# Altium schematic sheet WX0.007.418DL.SchDoc
size A3
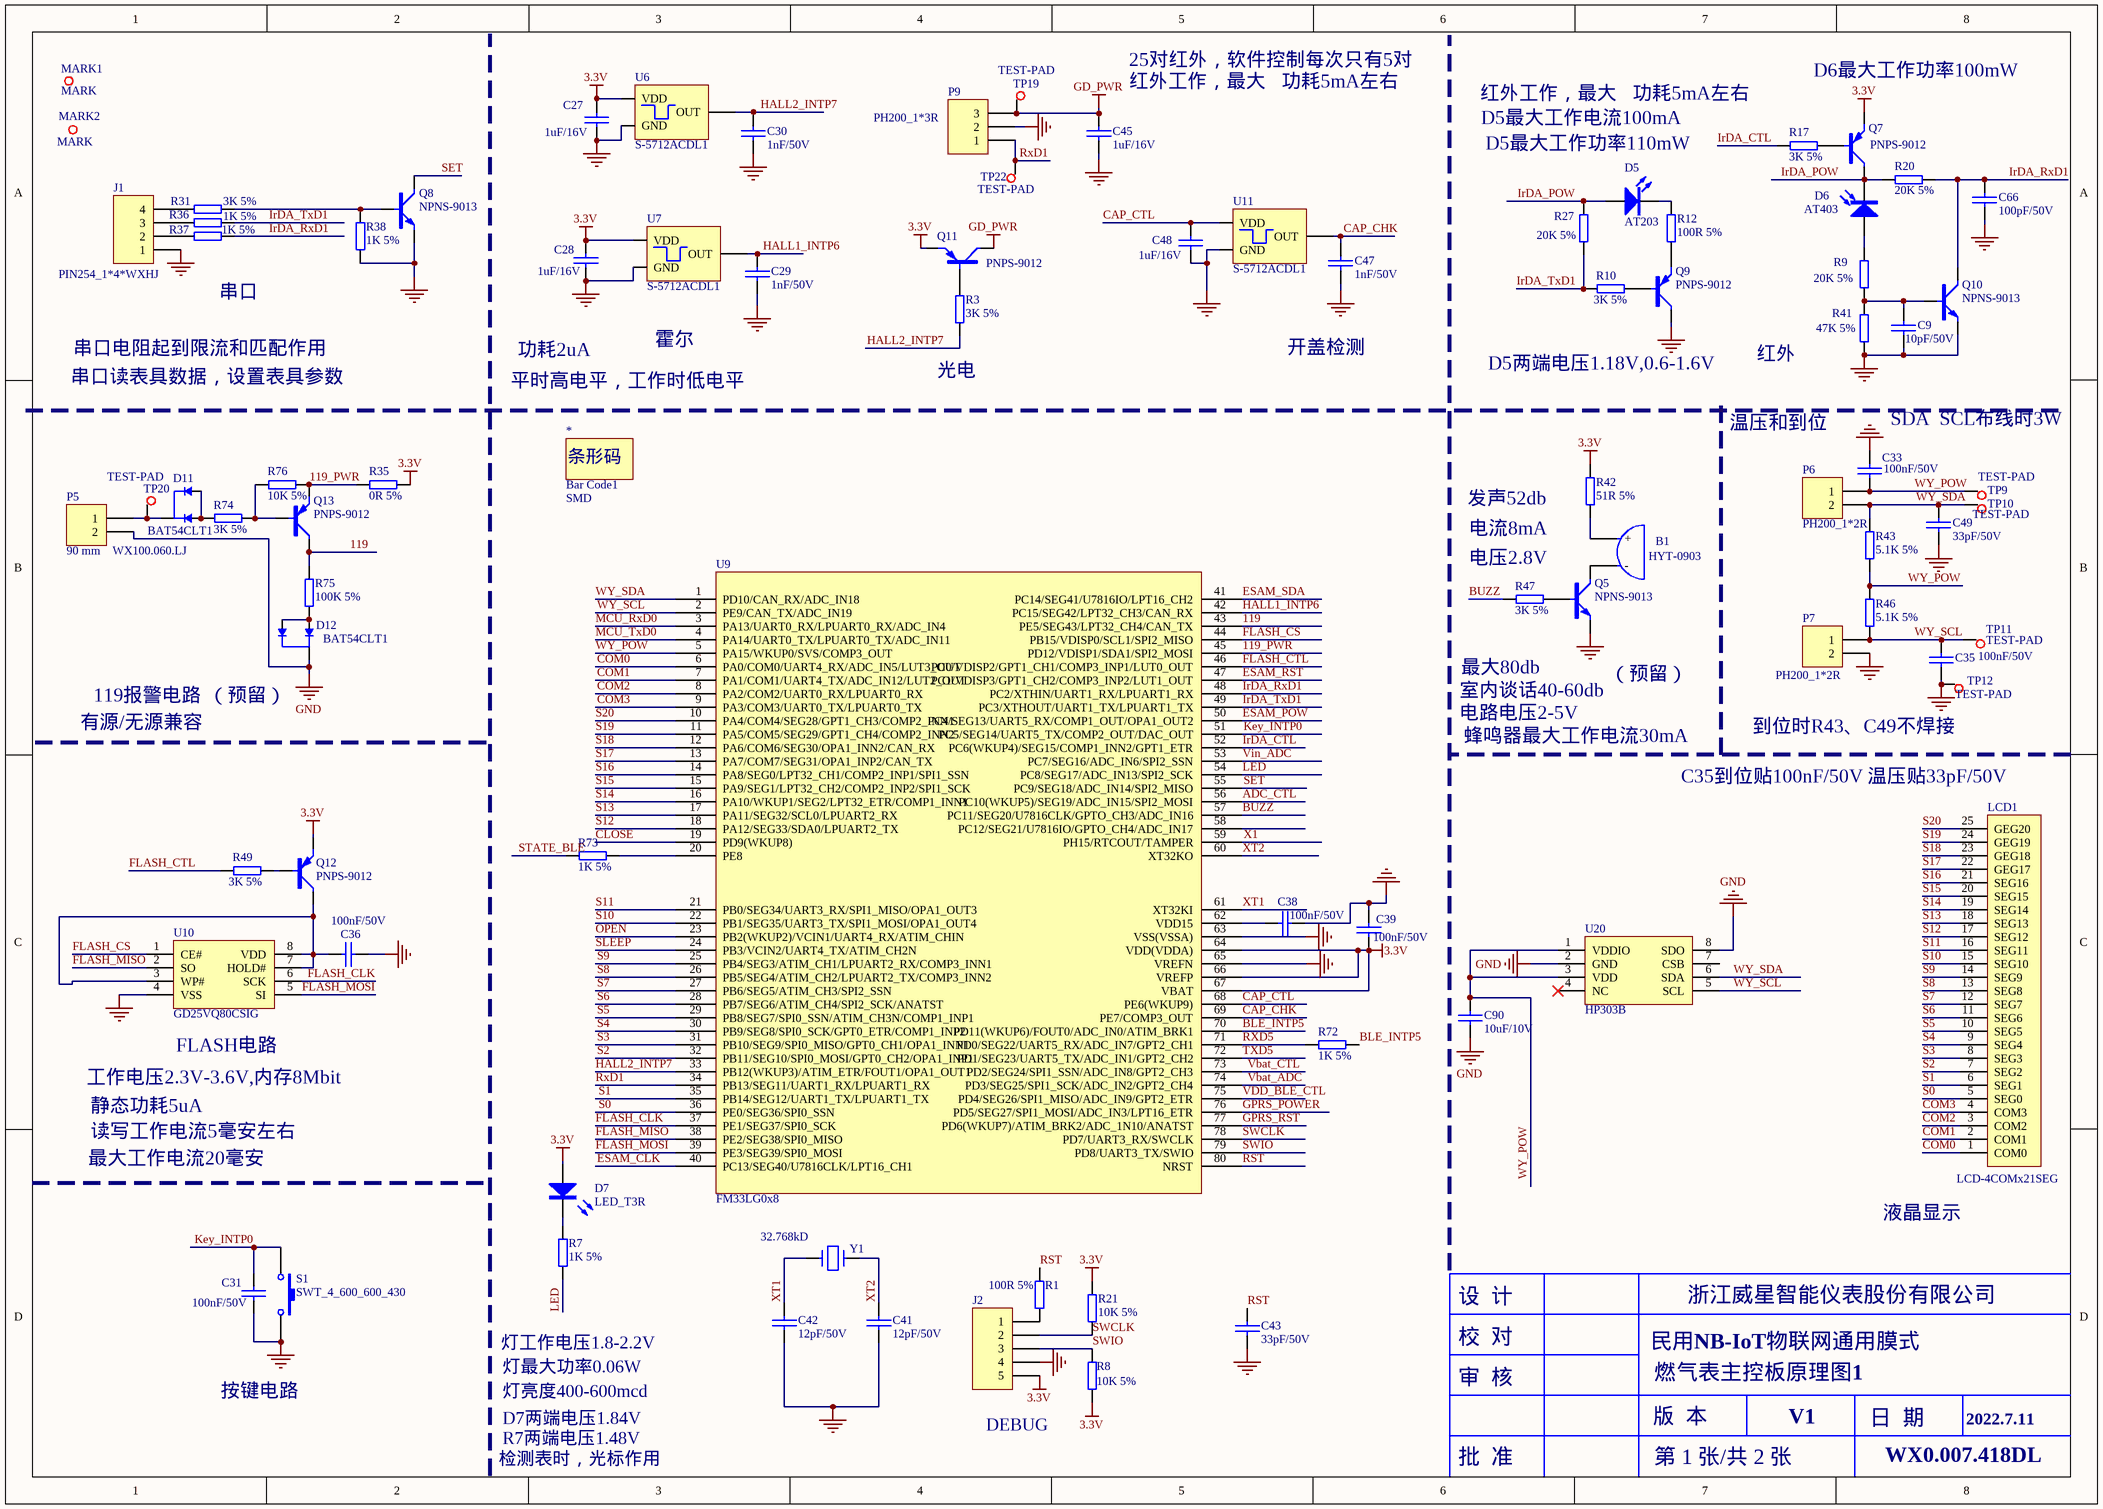
[diagram p0: WX0.007.418DL.SchDoc]

## Parts
*  Bar Code1  SMD/DIP: SMD  [Bar Code1]
B1  HYT-0903  [HYT-0903]
C9  10pF/50V  [CAP0603]
C27  1uF/16V  [CAP0603]
C28  1uF/16V  [CAP0603]
C29  1nF/50V  [CAP0603]
C30  1nF/50V  [CAP0603]
C31  100nF/50V  [CAP0603]
C33  100nF/50V  [CAP0603]
C35  100nF/50V  [CAP0603]
C36  100nF/50V  [CAP0603]
C38  100nF/50V  [CAP0603]
C39  100nF/50V  [CAP0603]
C41  12pF/50V  [CAP0603]
C42  12pF/50V  [CAP0603]
C43  33pF/50V  [CAP0603]
C45  1uF/16V  [CAP0603]
C47  1nF/50V  [CAP0603]
C48  1uF/16V  [CAP0603]
C49  33pF/50V  [CAP0603]
C66  100pF/50V  [CAP0603]
C90  10uF/10V  [CAP0603]
D5  AT203  [IR_254_532_300]
D6  AT403  [IR_254_532_300]
D7  LED_T3R  [LED2_300]
D11  BAT54CLT1  [SOT-23]
D12  BAT54CLT1  [SOT-23]
J1  PIN254_1*4*WXHJ  [PIN254_1*4*WXHJ]
J2  PIN254_1*5*WXHJ  [PIN254_1*5*WXHJ]  (value not drawn)
LCD1  SMD/DIP: LCD-4COMx21SEG  [LCD_GVH21861A-HPP]  (hidden comment: GVH26634A-HPP)
MARK1  MARK  [MARK]
MARK2  MARK  [MARK]
P5  90 mm    WX100.060.LJ  [WXHJ_Connect_01]
P6  PH200_1*2R  [PH200_1*2R]
P7  PH200_1*2R  [PH200_1*2R]
P9  PH200_1*3R  [PH200_1*3R]
Q5  NPNS-9013  [SOT-23]
Q7  PNPS-9012  [SOT-23]
Q8  NPNS-9013  [SOT-23]
Q9  PNPS-9012  [SOT-23]
Q10  NPNS-9013  [SOT-23]
Q11  PNPS-9012  [SOT-23]
Q12  PNPS-9012  [SOT-23]
Q13  PNPS-9012  [SOT-23]
R1  100R 5%  [RES0603]
R3  3K 5%  [RES0603]
R7  1K 5%  [RES0603]
R8  10K 5%  [RES0603]
R9  20K 5%  [RES0603]
R10  3K 5%  [RES0603]
R12  100R 5%  [RES0603]
R17  3K 5%  [RES0603]
R20  20K 5%  [RES0603]
R21  10K 5%  [RES0603]
R27  20K 5%  [RES0603]
R31  3K 5%  [RES0603]
R35  0R 5%  [RES1206]
R36  1K 5%  [RES0603]
R37  1K 5%  [RES0603]
R38  1K 5%  [RES0603]
R41  47K 5%  [RES0603]
R42  51R 5%  [RES0603]
R43  5.1K 5%  [RES0603]
R46  5.1K 5%  [RES0603]
R47  3K 5%  [RES0603]
R49  3K 5%  [RES0603]
R72  1K 5%  [RES0603]
R73  1K 5%  [RES0603]
R74  3K 5%  [RES0603]
R75  100K 5%  [RES0603]
R76  10K 5%  [RES0603]
S1  SWT_4_600_600_430  [SWT_4_600_600]
TP9  TEST-PAD  [TEST-PAD]
TP10  TEST-PAD  [TEST-PAD]
TP11  TEST-PAD  [TEST-PAD]
TP12  TEST-PAD  [TEST-PAD]
TP19  TEST-PAD  [TEST-PAD]
TP20  TEST-PAD  [TEST-PAD]
TP22  TEST-PAD  [TEST-PAD]
U6  S-5712ACDL1  [SOT-23]
U7  S-5712ACDL1  [SOT-23]
U9  FM33LG0x8  [LQFP80]
U10  GD25VQ80CSIG  [SOP-8L-200MIL]
U11  S-5712ACDL1  [SOT-23]
U20  HP303B  [LGA_8]
Y1  32.768kD  [SMD-3215_2P]

## Nets
3.3V: C27.1 C28.1 C39.2 D7.1 J2.5 Q7.2(E) Q11.2(E) Q12.2(E) R8.1 R21.1 R35.1 R42.2 U6.1(VDD) U7.1(VDD) U9.64(VDD(VDDA)) U9.66(VREFP) U9.67(VBAT)
GD_PWR: C45.1 P9.3 Q11.3(C) TP19.1
GND: C9.2 C27.2 C28.2 C29.2 C30.2 C31.2 C33.1 C35.2 C36.2 C38.2 C39.1 C41.1 C42.2 C43.2 C45.2 C47.2 C48.2 C49.2 C66.2 C90.1 D12.3(C) J1.1 J2.4 P5.2 P7.2 P9.2 Q5.2(E) Q8.2(E) Q9.3(C) Q10.2(E) R38.1 R41.1 S1.2 TP12.1 U6.3(GND) U7.3(GND) U9.63(VSS(VSSA)) U9.65(VREFN) U10.4(VSS) U11.3(GND) U20.2(GND) U20.8(SDO)
119: Q13.3(C) R75.2 U9.43(PE5/SEG43/LPT32_CH4/CAN_TX)
119_PWR: Q13.2(E) R35.2 R76.1 U9.45(PD12/VDISP1/SDA1/SPI2_MOSI)
ADC_CTL: U9.56(PC10(WKUP5)/SEG19/ADC_IN15/SPI2_MOSI)
BLE_INTP5: R72.1 U9.70(PD11(WKUP6)/FOUT0/ADC_IN0/ATIM_BRK1)
BUZZ: R47.1 U9.57(PC11/SEG20/U7816CLK/GPTO_CH3/ADC_IN16)
CAP_CHK: C47.1 U9.69(PE7/COMP3_OUT) U11.2(OUT)
CAP_CTL: C48.1 U9.68(PE6(WKUP9)) U11.1(VDD)
CLOSE: U9.19(PD9(WKUP8))
COM0: LCD1.1(COM0) U9.6(PA0/COM0/UART4_RX/ADC_IN5/LUT3_OUT)
COM1: LCD1.2(COM1) U9.7(PA1/COM1/UART4_TX/ADC_IN12/LUT2_OUT)
COM2: LCD1.3(COM2) U9.8(PA2/COM2/UART0_RX/LPUART0_RX)
COM3: LCD1.4(COM3) U9.9(PA3/COM3/UART0_TX/LPUART0_TX)
ESAM_CLK: U9.40(PC13/SEG40/U7816CLK/LPT16_CH1)
ESAM_POW: U9.50(PC4/SEG13/UART5_RX/COMP1_OUT/OPA1_OUT2)
ESAM_RST: U9.47(PC1/VDISP3/GPT1_CH2/COMP3_INP2/LUT1_OUT)
ESAM_SDA: U9.41(PC14/SEG41/U7816IO/LPT16_CH2)
FLASH_CLK: U9.37(PE1/SEG37/SPI0_SCK) U10.6(SCK)
FLASH_CS: U9.44(PB15/VDISP0/SCL1/SPI2_MISO) U10.1(CE#)
FLASH_CTL: R49.1 U9.46(PC0/VDISP2/GPT1_CH1/COMP3_INP1/LUT0_OUT)
FLASH_MISO: U9.38(PE2/SEG38/SPI0_MISO) U10.2(SO)
FLASH_MOSI: U9.39(PE3/SEG39/SPI0_MOSI) U10.5(SI)
GPRS_POWER: U9.76(PD5/SEG27/SPI1_MOSI/ADC_IN3/LPT16_ETR)
GPRS_RST: U9.77(PD6(WKUP7)/ATIM_BRK2/ADC_1N10/ANATST)
HALL1_INTP6: C29.1 U7.2(OUT) U9.42(PC15/SEG42/LPT32_CH3/CAN_RX)
HALL2_INTP7: C30.1 R3.1 U6.2(OUT) U9.33(PB12(WKUP3)/ATIM_ETR/FOUT1/OPA1_OUT1)
IrDA_CTL: R17.1 U9.52(PC6(WKUP4)/SEG15/COMP1_INN2/GPT1_ETR)
IrDA_POW: D5.1(A) D6.2(K) Q7.3(C) R20.1 R27.2
IrDA_RxD1: C66.1 Q10.3(C) R20.2 R37.2 U9.48(PC2/XTHIN/UART1_RX/LPUART1_RX)
IrDA_TxD1: R10.1 R27.1 R36.2 U9.49(PC3/XTHOUT/UART1_TX/LPUART1_TX)
Key_INTP0: C31.1 S1.1 U9.51(PC5/SEG14/UART5_TX/COMP2_OUT/DAC_OUT)
LED: R7.1 U9.54(PC8/SEG17/ADC_IN13/SPI2_SCK)
MCU_RxD0: U9.3(PA13/UART0_RX/LPUART0_RX/ADC_IN4)
MCU_TxD0: U9.4(PA14/UART0_TX/LPUART0_TX/ADC_IN11)
OPEN: U9.23(PB2(WKUP2)/VCIN1/UART4_RX/ATIM_CHIN)
RST: C43.1 R1.1 U9.80(NRST)
RxD1: P9.1 TP22.1 U9.34(PB13/SEG11/UART1_RX/LPUART1_RX)
RXD5: R72.2 U9.71(PD0/SEG22/UART5_RX/ADC_IN7/GPT2_CH1)
S0: LCD1.5(SEG0) U9.36(PE0/SEG36/SPI0_SSN)
S1: LCD1.6(SEG1) U9.35(PB14/SEG12/UART1_TX/LPUART1_TX)
S2: LCD1.7(SEG2) U9.32(PB11/SEG10/SPI0_MOSI/GPT0_CH2/OPA1_INP1)
S3: LCD1.8(SEG3) U9.31(PB10/SEG9/SPI0_MISO/GPT0_CH1/OPA1_INN1)
S4: LCD1.9(SEG4) U9.30(PB9/SEG8/SPI0_SCK/GPT0_ETR/COMP1_INP2)
S5: LCD1.10(SEG5) U9.29(PB8/SEG7/SPI0_SSN/ATIM_CH3N/COMP1_INP1)
S6: LCD1.11(SEG6) U9.28(PB7/SEG6/ATIM_CH4/SPI2_SCK/ANATST)
S7: LCD1.12(SEG7) U9.27(PB6/SEG5/ATIM_CH3/SPI2_SSN)
S8: LCD1.13(SEG8) U9.26(PB5/SEG4/ATIM_CH2/LPUART2_TX/COMP3_INN2)
S9: LCD1.14(SEG9) U9.25(PB4/SEG3/ATIM_CH1/LPUART2_RX/COMP3_INN1)
S10: LCD1.15(SEG10) U9.22(PB1/SEG35/UART3_TX/SPI1_MOSI/OPA1_OUT4)
S11: LCD1.16(SEG11) U9.21(PB0/SEG34/UART3_RX/SPI1_MISO/OPA1_OUT3)
S12: LCD1.17(SEG12) U9.18(PA12/SEG33/SDA0/LPUART2_TX)
S13: LCD1.18(SEG13) U9.17(PA11/SEG32/SCL0/LPUART2_RX)
S14: LCD1.19(SEG14) U9.16(PA10/WKUP1/SEG2/LPT32_ETR/COMP1_INN1)
S15: LCD1.20(SEG15) U9.15(PA9/SEG1/LPT32_CH2/COMP2_INP2/SPI1_SCK)
S16: LCD1.21(SEG16) U9.14(PA8/SEG0/LPT32_CH1/COMP2_INP1/SPI1_SSN)
S17: LCD1.22(GEG17) U9.13(PA7/COM7/SEG31/OPA1_INP2/CAN_TX)
S18: LCD1.23(GEG18) U9.12(PA6/COM6/SEG30/OPA1_INN2/CAN_RX)
S19: LCD1.24(GEG19) U9.11(PA5/COM5/SEG29/GPT1_CH4/COMP2_INN2)
S20: LCD1.25(GEG20) U9.10(PA4/COM4/SEG28/GPT1_CH3/COMP2_INN1)
SET: Q8.3(C) U9.55(PC9/SEG18/ADC_IN14/SPI2_MISO)
SLEEP: U9.24(PB3/VCIN2/UART4_TX/ATIM_CH2N)
STATE_BLE: R73.2
SWCLK: J2.2 R21.2 U9.78(PD7/UART3_RX/SWCLK)
SWIO: J2.3 R8.2 U9.79(PD8/UART3_TX/SWIO)
TXD5: U9.72(PD1/SEG23/UART5_TX/ADC_IN1/GPT2_CH2)
Vbat_ADC: U9.74(PD3/SEG25/SPI1_SCK/ADC_IN2/GPT2_CH4)
Vbat_CTL: U9.73(PD2/SEG24/SPI1_SSN/ADC_IN8/GPT2_CH3)
VDD_BLE_CTL: U9.75(PD4/SEG26/SPI1_MISO/ADC_IN9/GPT2_ETR)
Vin_ADC: U9.53(PC7/SEG16/ADC_IN6/SPI2_SSN)
WY_POW: C33.2 C90.2 P6.1 R43.1 R46.2 TP9.1 U9.5(PA15/WKUP0/SVS/COMP3_OUT) U20.1(VDDIO) U20.3(VDD)
WY_SCL: C35.1 P7.1 R46.1 TP11.1 U9.2(PE9/CAN_TX/ADC_IN19) U20.5(SCL)
WY_SDA: C49.1 P6.2 R43.2 TP10.1 U9.1(PD10/CAN_RX/ADC_IN18) U20.6(SDA)
X1: U9.59(PH15/RTCOUT/TAMPER)
XT1: C42.1 U9.61(XT32KI) Y1.1
XT2: C41.2 U9.60(XT32KO) Y1.2
NetB1_1: B1.1(+) R42.1
NetB1_2: B1.2(-) Q5.3(C)
NetC9_1: C9.1 Q10.1(B) R9.1 R41.2
NetC36_1: C36.1 Q12.3(C) U10.3(WP#) U10.7(HOLD#) U10.8(VDD)
NetC38_1: C38.1 U9.62(VDD15)
NetD5_2: D5.2(K) R12.2
NetD6_1: D6.1(A) R9.2
NetD7_2: D7.2 R7.2
NetD11_1: D11.1(A) D11.2(A) R74.2
NetD11_3: D11.3(C) P5.1 TP20.1
NetD12_1: D12.1(A) D12.2(A) R75.1
NetJ1_2: J1.2 R37.1
NetJ1_3: J1.3 R36.1
NetJ1_4: J1.4 R31.1
NetJ2_1: J2.1 R1.2
NetQ5_1: Q5.1(B) R47.2
NetQ7_1: Q7.1(B) R17.2
NetQ8_1: Q8.1(B) R31.2 R38.2
NetQ9_1: Q9.1(B) R10.2
NetQ9_2: Q9.2(E) R12.1
NetQ11_1: Q11.1(B) R3.2
NetQ12_1: Q12.1(B) R49.2
NetQ13_1: Q13.1(B) R74.1 R76.2
NetR73_1: R73.1 U9.20(PE8)

Not connected (* = marked no-connect by the designer): U9 58(PC12/SEG21/U7816IO/GPTO_CH4/ADC_IN17); U20 4(NC)* 7(CSB)

## Notes on the sheet
- 25对红外，软件控制每次只有5对
- (near C45) 红外工作，最大
- 功耗5mA左右
- 红外工作，最大
- D6最大工作功率100mW
- D5最大工作电流100mA
- D5最大工作功率110mW
- 串口
- 串口读表具数据，设置表具参数
- 串口电阻起到限流和匹配作用
- 功耗2uA
- 霍尔
- (near R3) 光电
- 开盖检测
- D5两端电压1.18V,0.6-1.6V
- 红外
- 平时高电平，工作时低电平
- 温压和到位
- SDA  SCL布线时3W
- 发声52db
- 电流8mA
- 电压2.8V
- 119报警电路
- (near D12) （预留）
- 电路电压2-5V
- 室内谈话40-60db
- 最大80db
- (near Q5) （预留）
- 有源/无源兼容
- 蜂鸣器最大工作电流30mA
- C35到位贴100nF/50V 温压贴33pF/50V
- 到位时R43、C49不焊接
- (near U10) FLASH电路
- 工作电压2.3V-3.6V,内存8Mbit
- 静态功耗5uA
- 最大工作电流20毫安
- 读写工作电流5毫安左右
- (near LCD1) 液晶显示
- 设  计
- 浙江威星智能仪表股份有限公司
- 按键电路
- 灯工作电压1.8-2.2V
- 灯最大功率0.06W
- 灯亮度400-600mcd
- 审  核
- 校  对
- 民用NB-IoT物联网通用膜式
- 燃气表主控板原理图1
- D7两端电压1.84V
- R7两端电压1.48V
- (near J2) DEBUG
- 版  本
- V1
- 日  期
- WX0.007.418DL
- 2022.7.11
- 检测表时，光标作用
- 批  准
- 第 1 张/共 2 张

## Library data of the parts
* = AD_WXHJ_Bar Code_02: 条形码 ,填充，无需焊接器件; ID: 17; Part Number: AD_WXHJ_Bar Code_02; Part Name: 条形码
B1 = 1010602-0007: 直插,直径9mm,高5.5mm,5 V,2 V,30 mA,兴化市华宇电子有限公司,HYT-0903; Part Name: 有源蜂鸣器; ID: 28; SMD/DIP: DIP; Part Number: 1010602-0007
C9 = 101020103-0014: 10pF,50 V,±5%,0603,X7R,国巨,CC0603JRNPO9BN100; Part Name: 0603贴片电容; ID: 7; SMD/DIP: SMD; Part Number: 101020103-0014
C27 C28 C45 C48 = 101020103-0003: 105pF,16 V,±10%,0603,国巨,CC0603KRX7R7BB105; Part Name: 0603贴片电容; ID: 14; SMD/DIP: SMD; Part Number: 101020103-0003
C29 C30 C47 = 101020103-0022: 102pF,50 V,±10%,0603,国巨,CC0603KRX7R9BB102; Part Name: 0603贴片电容; ID: 13; SMD/DIP: SMD; Part Number: 101020103-0022
C31 C33 C35 C36 C38 C39 = 101020103-0021: 104pF,50 V,±10%,0603,国巨,CC0603KRX7R9BB104; Part Name: 0603贴片电容; ID: 3; SMD/DIP: SMD; Part Number: 101020103-0021
C41 C42 = 101020103-0005: 12P,50 V,±5%,0603,国巨,CC0603JRNPO9BN12; Part Name: 0603贴片电容; ID: 11; SMD/DIP: SMD; Part Number: 101020103-0005
C43 = 101020103-0027: 33pF,50 V,±10%,0603,国巨,CC0603KRNPO9BN33; Part Name: 0603贴片电容; ID: 17; SMD/DIP: SMD; Part Number: 101020103-0027
C49 = 101020103-0027: 33pF,50 V,±10%,0603,国巨,CC0603KRNPO9BN33; Part Name: 0603贴片电容; ID: 18; SMD/DIP: SMD; Part Number: 101020103-0027
C66 = 101020103-0010: 101pf,50 V,±5%,0603,国巨,CC0603JRNP09BN101; Part Name: 0603贴片电容; ID: 4; SMD/DIP: SMD; Part Number: 101020103-0010
C90 = 101020103-0026: 106pF,10 V,±10%,0603,村田,GRM188R61A106KE47D; Part Name: 0603贴片电容; ID: 8; SMD/DIP: SMD; Part Number: 101020103-0026
D5 = 101040102-0010: DIP-2,φ3,插件,红光,上海品观电子有限公司/可得,AT203; Part Name: 红外发射管; ID: 1; SMD/DIP: DIP; Part Number: 101040102-0010
D6 = 101040102-0011: DIP-2,φ3,插件,红光,上海品观电子有限公司/可得,AT403-PD-01; Part Name: 光敏二极管; ID: 3; SMD/DIP: DIP; Part Number: 101040102-0011
D7 = 101040102-0001: 圆形插件,3mm 圆形,插件,红光,湖北匡通电子有限公司,3BB4HC; Part Name: 发光二极管; ID: 6; SMD/DIP: DIP; Part Number: 101040102-0001
D11 D12 = 101040101-0038: BAT54CLT1，SOT23-3,SOT23-3,0.2 A,0.8 V,30 V,安森美,BAT54CLT1; Part Name: 贴片肖特基; ID: 31; SMD/DIP: SMD; Part Number: 101040101-0038
J1 = AD_WXHJ_PinHeader_01: 1*4 ，Φ1.0 ，2.54mm，直脚,无需焊接器件; Part Name: 排针; ID: 16; SMD/DIP: DIP; Part Number: AD_WXHJ_PinHeader_01
J2 = AD_WXHJ_PinHeader_02: 1*5 ，Φ1.0 ，2.54mm，直脚,无需焊接器件; Part Name: 排针; ID: 17; SMD/DIP: DIP; Part Number: AD_WXHJ_PinHeader_02
LCD1 = 1010801-0055: GVH26634A-HPP-WG,65mm*23mm,针脚,段码,21,液晶,全透,70 ℃,-20 ℃,安徽金视界光电科技有限公司,GVH26634A-HPP-WG; Part Name: LCD液晶屏; ID: 18; Part Number: 1010801-0055
MARK1 MARK2 = AD_WXHJ_MARK_01: MARK点; ID: 8; SMD/DIP: SMD; Part Number: AD_WXHJ_MARK_01; Part Name: MARK点
P5 = AD_WXHJ_Connect_01: 电源连接线; Part Name: 电源线焊盘; ID: 26; SMD/DIP: DIP; Part Number: AD_WXHJ_Connect_01
P6 P7 = 1010902-0105: 2.0-2AW,直插弯座，2PIN，脚间距2mm，带防翘起,公头,单排,2.0-2AW;直插弯座，2PIN,脚间距2mm，带防翘起; Part Name: PH座; ID: 11; SMD/DIP: DIP; Part Number: 1010902-0105
P9 = 1010902-0104: 2.0-3AW,3PIN，2mm脚间距,公头,单排,2.0-3AW；3PIN，脚间距2mm直插弯座带防翘起; Part Name: PH座; ID: 12; SMD/DIP: DIP; Part Number: 1010902-0104
Q5 Q8 Q10 = 101040201-0002: 9013,NPN,SOT-23,长电,S9013; Part Name: 贴片三极管; ID: 14; SMD/DIP: SMD; Part Number: 101040201-0002
Q7 Q9 Q11 Q12 = 101040201-0001: 9012,PNP,SOT-23,JCET;长电,S9012; Part Name: 贴片三极管; ID: 16; SMD/DIP: SMD; Part Number: 101040201-0001
Q13 = 101040201-0001: 9012,PNP,SOT-23,JCET;长电,S9012; Part Name: 贴片三极管; ID: 17; SMD/DIP: SMD; Part Number: 101040201-0001
R1 R12 = 101010103-0022: 100R,±5%,1/10W,0603,国巨,RC0603JR-07100RL; Part Name: 0603贴片电阻; ID: 5; SMD/DIP: SMD; Part Number: 101010103-0022
R3 R10 R17 R31 R47 R49 = 101010103-0006: 国巨,±5%,0603,,155 ℃,-55 ℃,RC0603JR-073KL,无铅,100 ppm/℃,1/10W,,3K; Part Name: 0603贴片电阻; ID: 22; SMD/DIP: SMD; Part Number: 101010103-0006
R7 R36 R37 = 101010103-0008: 1K,±5%,1/10W,0603,国巨,RC0603JR-071KL; Part Name: 0603贴片电阻; ID: 9; SMD/DIP: SMD; Part Number: 101010103-0008
R8 R21 R76 = 101010103-0003: 国巨,±5%,0603,,155 ℃,-55 ℃,RC0603JR-0710KL,无铅,200 ppm/℃,1/10W,,10K; Part Name: 0603贴片电阻; ID: 7; SMD/DIP: SMD; Part Number: 101010103-0003
R9 R20 R27 = 101010103-0004: 国巨,±5%,0603,,155 ℃,-55 ℃,RC0603JR-0720KL,无铅,200 ppm/℃,1/10W,,20K; Part Name: 0603贴片电阻; ID: 15; SMD/DIP: SMD; Part Number: 101010103-0004
R35 = 101010101-0013: 0Ω,±5%,1/4W,1206,国巨,RC1206JR-070RL; Part Name: 1206贴片电阻; ID: 2; SMD/DIP: SMD; Part Number: 101010101-0013
R38 R72 R73 = 101010103-0008: 1K,±5%,1/10W,0603,国巨,RC0603JR-071KL; Part Name: 0603贴片电阻; ID: 10; SMD/DIP: SMD; Part Number: 101010103-0008
R41 = 101010103-0012: 47K,±5%,1/10W,0603,国巨,RC0603JR-0747KL; Part Name: 0603贴片电阻; ID: 25; SMD/DIP: SMD; Part Number: 101010103-0012
R42 = 101010103-0037: 国巨,±5%,0603,,155 ℃,-55 ℃,RC0603JR-0751RL,无铅,100 ppm/℃,1/10W,,51欧; Part Name: 0603贴片电阻; ID: 28; SMD/DIP: SMD; Part Number: 101010103-0037
R43 R46 = 101010103-0015: 国巨,±5%,0603,,155 ℃,55 ℃,RC0603JR-075.1KL,无铅,200 ppm/℃,1/10W,,5.1k; Part Name: 0603贴片电阻; ID: 26; SMD/DIP: SMD; Part Number: 101010103-0015
R74 = 101010103-0006: 国巨,±5%,0603,,155 ℃,-55 ℃,RC0603JR-073KL,无铅,100 ppm/℃,1/10W,,3K; Part Name: 0603贴片电阻; ID: 23; SMD/DIP: SMD; Part Number: 101010103-0006
R75 = 101010103-0005: 国巨,±5%,0603,,155 ℃,-55 ℃,RC0603JR-07100KL,无铅,100 ppm/℃,1/10W,,100K; Part Name: 0603贴片电阻; ID: 3; SMD/DIP: SMD; Part Number: 101010103-0005
S1 = 1011001-0027: TS-1102,机械轻触,6*6*4.3直插,6*6*4.3直插,乐清市羽欧电子; Part Name: 按键; ID: 30; SMD/DIP: DIP; Part Number: 1011001-0027
TP9-TP12 TP19 TP20 TP22 = AD_WXHJ_TEST-PAD_01: 单面焊盘测试点; Part Name: 测试点; ID: 23; SMD/DIP: SMD; Part Number: AD_WXHJ_TEST-PAD_01
U6 U7 U11 = 1010504-0002: S-5712ACDL1,SOT23-3,3.5 V,1.6 V,2 uA,精工电子,S-5712ACDL1; Part Name: 霍尔元件; ID: 2; SMD/DIP: SMD; Part Number: 1010504-0002
U10 = 101050101-0165: GD25VQ80CSIG,SOP8 208mil,北京兆易创新科技股份有限公司,GD25VQ80CSIG; Part Name: 贴片存储芯片FLASH; ID: 13; SMD/DIP: SMD; Part Number: 101050101-0165
Y1 = 1010601-0009: Part Number: 1010601-0020; Part Name: 贴片晶振; ID: 20; SMD/DIP: SMD